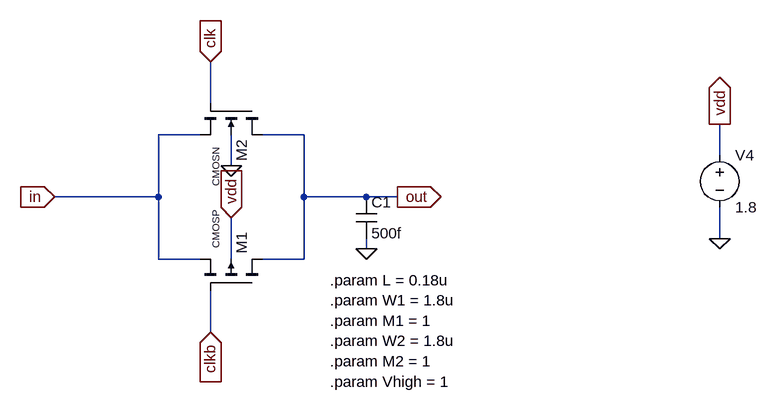
[diagram p0: schematic transmisson_gate.asc]
transmisson_gate.asc, the LTspice schematic file:
Version 4
SHEET 1 1316 680
WIRE 192 -240 192 -304
WIRE 176 -192 112 -192
WIRE 336 -192 272 -192
WIRE 976 -160 976 -208
WIRE 224 -144 224 -192
WIRE 112 -96 112 -192
WIRE 112 -96 -48 -96
WIRE 336 -96 336 -192
WIRE 432 -96 336 -96
WIRE 480 -96 432 -96
WIRE 976 -32 976 -80
WIRE 432 -16 432 -32
WIRE 112 0 112 -96
WIRE 176 0 112 0
WIRE 224 0 224 -64
WIRE 336 0 336 -96
WIRE 336 0 272 0
WIRE 192 112 192 48
FLAG 224 -144 0
FLAG 224 -64 vdd
IOPIN 224 -64 In
FLAG 192 -304 clk
IOPIN 192 -304 In
FLAG 192 112 clkb
IOPIN 192 112 In
FLAG 480 -96 out
IOPIN 480 -96 Out
FLAG -48 -96 in
IOPIN -48 -96 In
FLAG 976 -32 0
FLAG 976 -208 vdd
IOPIN 976 -208 Out
FLAG 432 -16 0
SYMBOL pmos4 272 48 M270
WINDOW 3 94 72 Center 1
SYMATTR InstName M1
SYMATTR Value CMOSP
SYMATTR Value2 l={L} w={W1} m={M1}
SYMBOL nmos4 272 -240 R90
WINDOW 3 98 72 Center 1
SYMATTR InstName M2
SYMATTR Value CMOSN
SYMATTR Value2 l={L} w={W2} m={M2}
SYMBOL voltage 976 -176 R0
WINDOW 123 0 0 Left 0
WINDOW 39 0 0 Left 0
SYMATTR InstName V4
SYMATTR Value 1.8
SYMBOL cap 416 -96 R0
SYMATTR InstName C1
SYMATTR Value 500f
TEXT 376 32 Left 2 !.param L = 0.18u\n.param W1 = 1.8u\n.param M1 = 1\n.param W2 = 1.8u\n.param M2 = 1\n.param Vhigh = 1

The netlist it stands for:
* transmisson_gate.asc
M1 out clkb in vdd CMOSP l={L} w={W1} m={M1}
M2 out clk in 0 CMOSN l={L} w={W2} m={M2}
V4 vdd 0 1.8
C1 out 0 500f
.model NMOS NMOS
.model PMOS PMOS
.lib standard.mos
.param L = 0.18u
.param W1 = 1.8u
.param M1 = 1
.param W2 = 1.8u
.param M2 = 1
.param Vhigh = 1
.backanno
.end